# Altium project Анализатор .034 -лист 4.PrjPcb
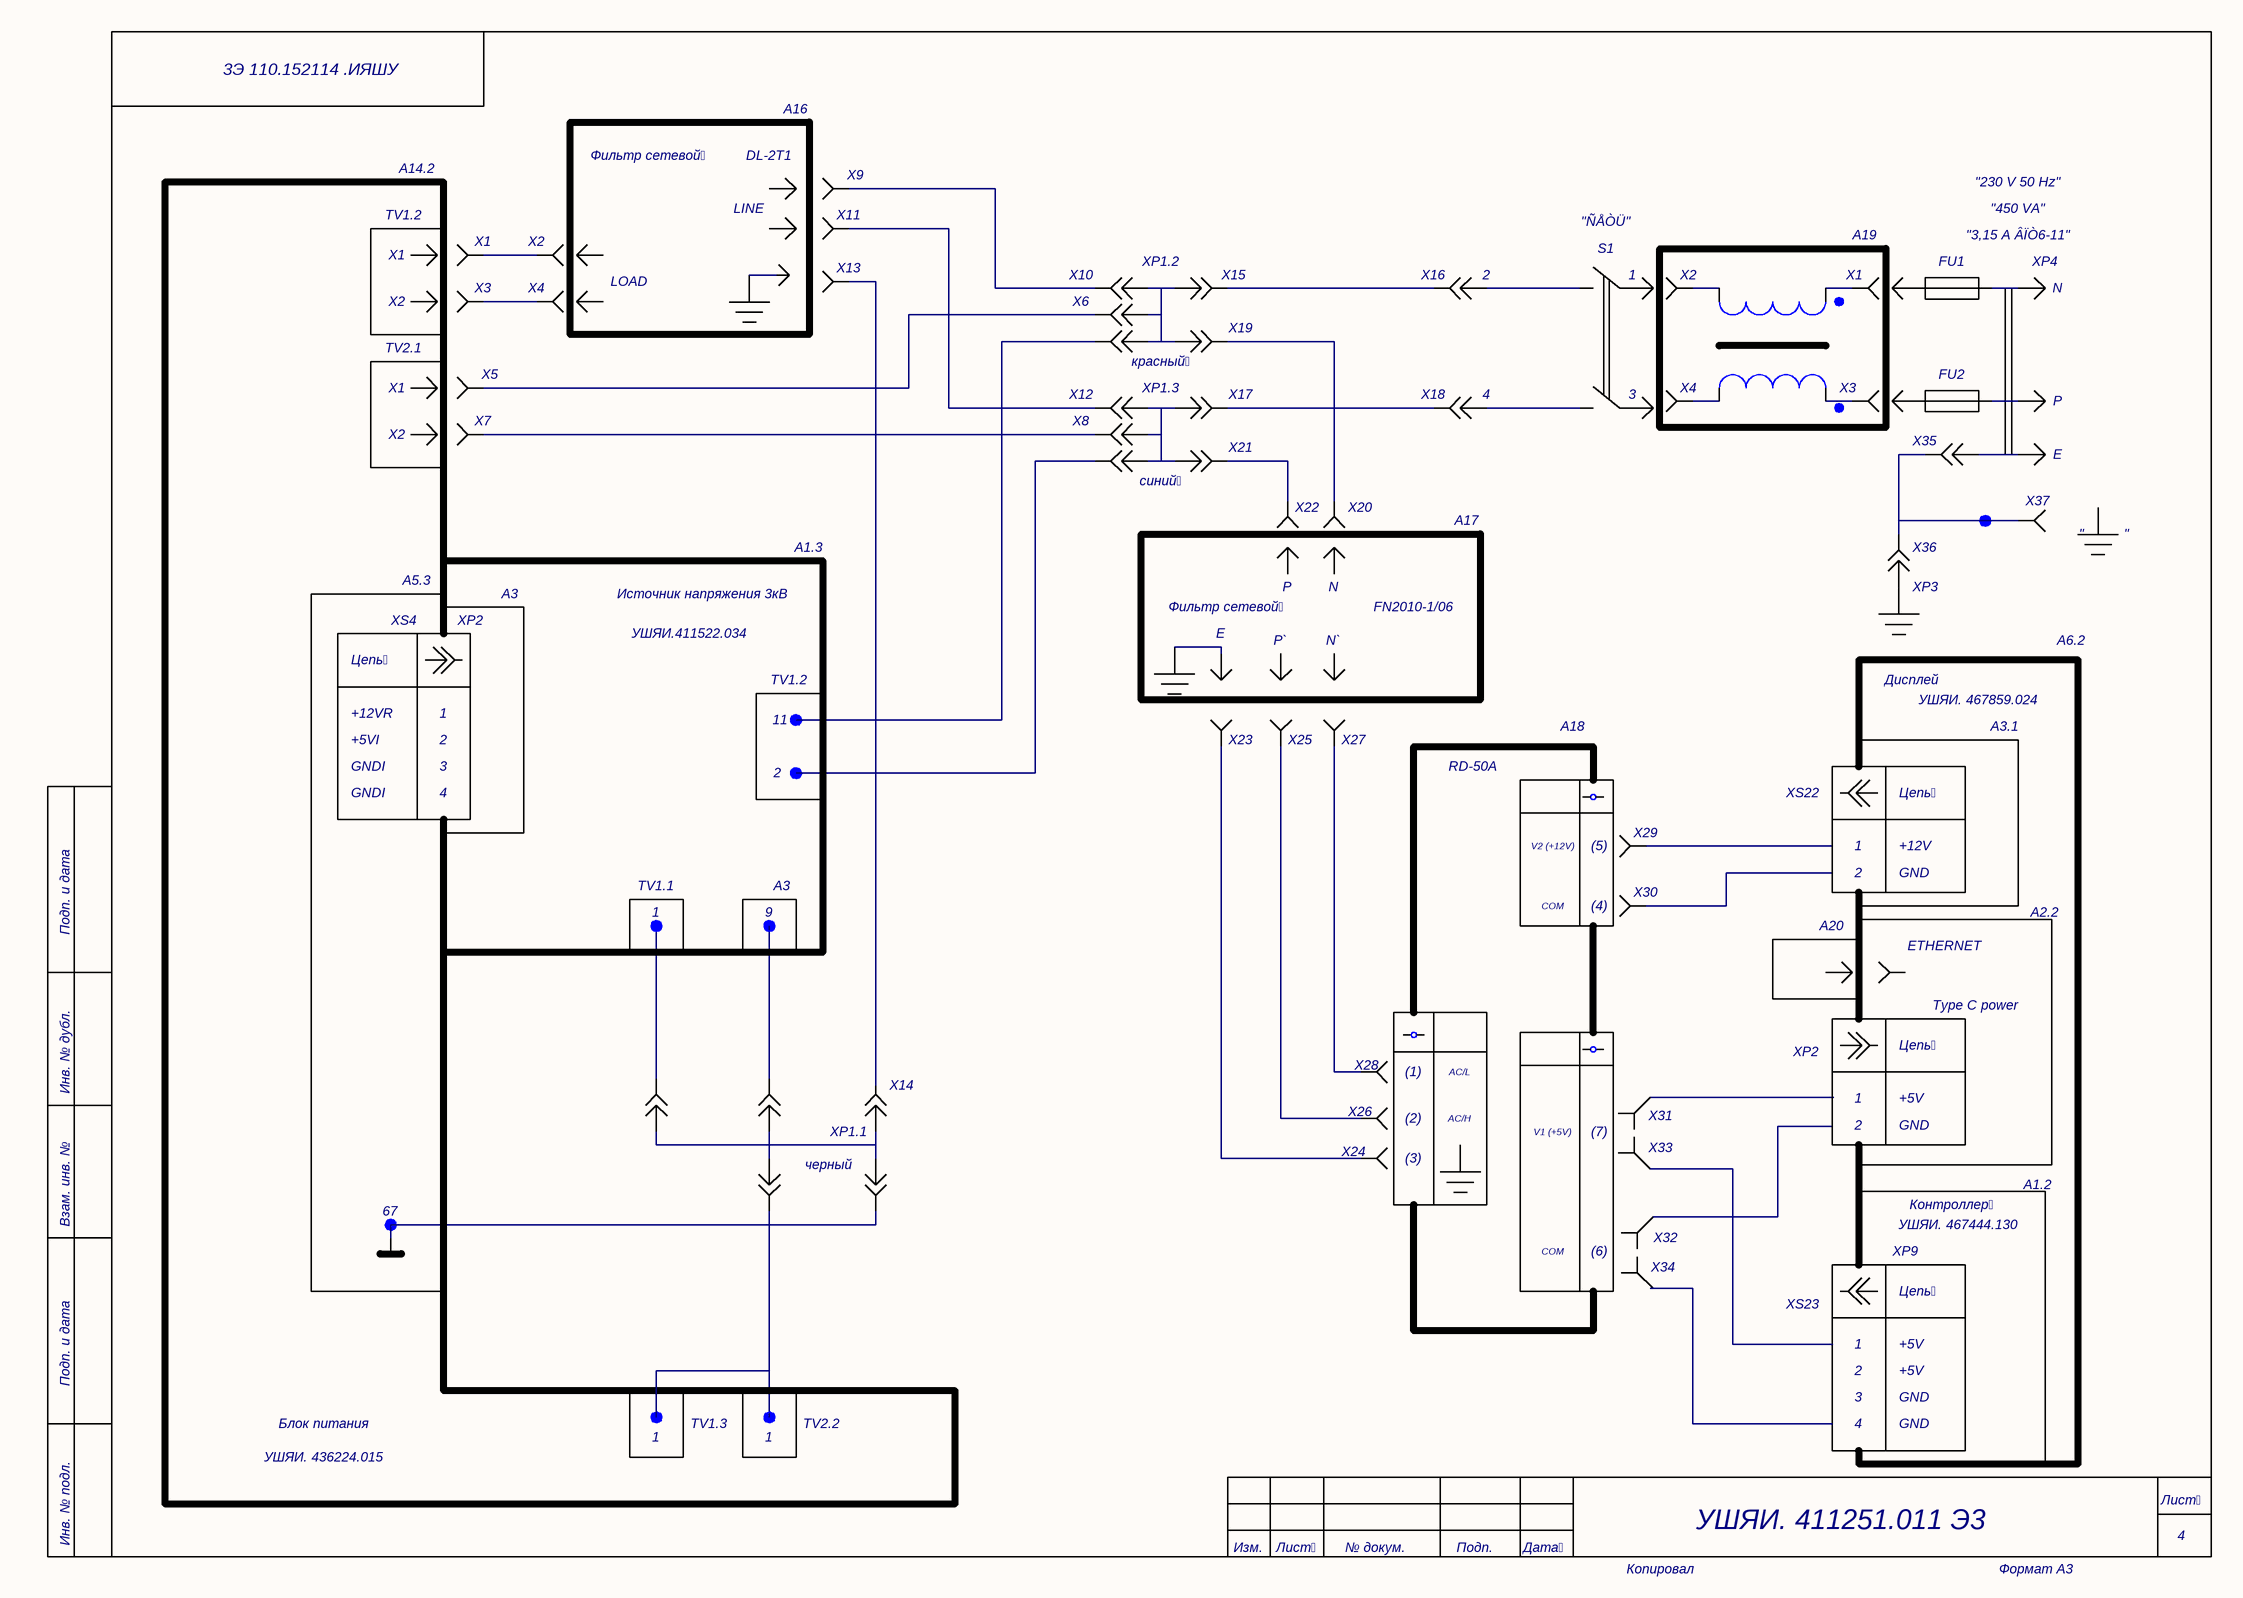
[diagram p0: Sheet1.SCHDOC]
1 sheet, 101 parts. Net scope: global (net labels, ports and power ports of the same name join across sheets).

## Sheet Sheet1.SCHDOC
size 420 x 297 mm; SheetNumber: 1; SheetTotal: 1; DocumentName: Sheet1.SCHDOC

### Parts
39  VT2  (value not drawn)
40  VT2  (value not drawn)
41  VT2  (value not drawn)
42  VT2  (value not drawn)
FU1  RESISTANCE  (value not drawn)
FU2  RESISTANCE  (value not drawn)
S1  KEY  (value not drawn)
U81  SOCKET  (value not drawn)
U172  KEY  (value not drawn)
U173  POINT (SMALL)  (value not drawn)
U174  POINT (SMALL)  (value not drawn)
U200  PLUG  (value not drawn)
U201  PLUG  (value not drawn)
U202  PLUG  (value not drawn)
U203  PLUG  (value not drawn)
U204  PLUG  (value not drawn)
U205  PLUG  (value not drawn)
U207  PLUG  (value not drawn)
U208  PLUG  (value not drawn)
U212  PLUG  (value not drawn)
U213  PLUG  (value not drawn)
U214  PLUG  (value not drawn)
U215  PLUG  (value not drawn)
U216  PLUG  (value not drawn)
U217  PLUG  (value not drawn)
U219  PLUG  (value not drawn)
U221  PLUG  (value not drawn)
U222  PLUG  (value not drawn)
U223  PLUG  (value not drawn)
U224  PLUG  (value not drawn)
U225  PLUG  (value not drawn)
U226  PLUG  (value not drawn)
U227  PLUG  (value not drawn)
U233  PLUG  (value not drawn)
U234  PLUG  (value not drawn)
U235  PLUG  (value not drawn)
U236  PLUG  (value not drawn)
U237  PLUG  (value not drawn)
U238  GROUND  (value not drawn)
U239  CASE  (value not drawn)
U240  PLUG  (value not drawn)
U241  PLUG  (value not drawn)
U249  CASE  (value not drawn)
U251  PLUG  (value not drawn)
U252  CASE  (value not drawn)
U253  PLUG  (value not drawn)
U254  CASE  (value not drawn)
U255  PLUG  (value not drawn)
U256  CASE  (value not drawn)
U260  PLUG  (value not drawn)
U261  PLUG  (value not drawn)
U262  PLUG  (value not drawn)
U265  PLUG  (value not drawn)
U266  PLUG  (value not drawn)
U267  PLUG  (value not drawn)
U268  PLUG  (value not drawn)
U269  PLUG  (value not drawn)
XP1  PLUG  (value not drawn)
XS24  SOCKET  (value not drawn)
XS25  SOCKET  (value not drawn)
XS26  SOCKET  (value not drawn)
XS27  SOCKET  (value not drawn)
XS28  SOCKET  (value not drawn)
XS29  SOCKET  (value not drawn)
XS30  SOCKET  (value not drawn)
XS31  SOCKET  (value not drawn)
XS32  SOCKET  (value not drawn)
XS33  SOCKET  (value not drawn)
XS34  SOCKET  (value not drawn)
XS35  SOCKET  (value not drawn)
XS36  SOCKET  (value not drawn)
XS37  SOCKET  (value not drawn)
XS38  SOCKET  (value not drawn)
XS39  SOCKET  (value not drawn)
XS40  SOCKET  (value not drawn)
XS41  SOCKET  (value not drawn)
XS42  SOCKET  (value not drawn)
XS43  SOCKET  (value not drawn)
XS44  SOCKET  (value not drawn)
XS45  SOCKET  (value not drawn)
XS46  SOCKET  (value not drawn)
XS47  SOCKET  (value not drawn)
XS48  SOCKET  (value not drawn)
XS49  SOCKET  (value not drawn)
XS50  SOCKET  (value not drawn)
XS52  SOCKET  (value not drawn)
XS53  SOCKET  (value not drawn)
XS55  SOCKET  (value not drawn)
XS56  SOCKET  (value not drawn)
XS57  SOCKET  (value not drawn)
XS58  SOCKET  (value not drawn)
XS59  SOCKET  (value not drawn)
XS60  SOCKET  (value not drawn)
XS61  SOCKET  (value not drawn)
XS62  SOCKET  (value not drawn)
XS63  SOCKET  (value not drawn)
XS64  SOCKET  (value not drawn)
XS65  SOCKET  (value not drawn)
XS66  SOCKET  (value not drawn)
XS67  SOCKET  (value not drawn)
XS68  SOCKET  (value not drawn)

### Nets
Net39_0: 39.0 XS26.1
Net40_0: 40.0 XS28.1
Net41_0: 41.0 XS29.1
Net42_0: 42.0 XS27.1
NetFU1_1: FU1.1 U204.1
NetFU1_2: FU1.2 XP1.1
NetFU2_1: FU2.1 U205.1
NetFU2_2: FU2.2 U207.1
NetS1_1: S1.1 U202.1
NetS1_2: S1.2 U200.1
NetU172_1: U172.1 U203.1
NetU172_2: U172.2 U201.1
NetU208_1: U208.1 U222.1
NetU212_1: U212.1 U213.1 U214.1 U217.1 U219.1
NetU215_1: U215.1 U216.1 U221.1 U224.1 U225.1
NetU223_1: U223.1 U239.1(DGND)
NetU233_1: U233.1 U234.1 U235.1 U236.1 U237.1
NetU238_1: U238.1 XS62.1
NetU252_1: U252.1(DGND) U261.1
NetU254_1: U254.1(DGND) U262.1
NetXS24_1: XS24.1 XS30.1
NetXS25_1: XS25.1 XS53.1
NetXS32_1: XS32.1 XS61.1
NetXS34_1: XS34.1 XS55.1
NetXS35_1: XS35.1 XS57.1
NetXS36_1: XS36.1 XS58.1
NetXS39_1: XS39.1 XS46.1
NetXS40_1: XS40.1 XS41.1
NetXS42_1: XS42.1 XS60.1
NetXS43_1: XS43.1 XS44.1 XS45.1
NetXS47_1: XS47.1 XS59.1
NetXS48_1: XS48.1 XS52.1
NetXS50_1: XS50.1 XS56.1
NetXS63_1: XS63.1 XS66.1
NetXS64_1: XS64.1 XS65.1

Not connected (* = marked no-connect by the designer): U81 1; U173 0; U174 0; U226 1; U227 1; U240 1; U241 1; U249 1(DGND); U251 1; U253 1; U255 1; U256 1(DGND); U260 1; U265 1; U266 1; U267 1; U268 1; U269 1; XS31 1; XS33 1; XS37 1; XS38 1; XS49 1; XS67 1; XS68 1

### Notes on the sheet
- 3Э 110.152114 .ИЯШУ
- A16
- A14.2
- Фильтр сетевой
- (near U265) DL-2T1
- (near XS55) X9
- "230 V 50 Hz"
- (near U240) X1
- (near U240) TV1.2
- (near XS60) X1
- (near XS42) X2
- LINE
- (near XS56) X11
- XP1.2
- S1
- "ÑÅÒÜ"
- A19
- (near FU1) FU1
- "450 VA"
- "3,15 A ÂÏÒ6-11"
- (near XP1) XP4
- (near U251) X2
- (near XS59) X3
- (near XS47) X4
- LOAD
- (near XS61) X13
- X6
- (near XS34) X10
- (near XS30) X15
- (near XS41) X19
- (near XS24) X16
- (near U200) 2
- 1
- (near XS26) X2
- X1
- (near XP1) N
- (near U241) X1
- TV2.1
- (near XS64) X5
- (near XS50) X12
- XP1.3
- красный
- (near XS53) X17
- (near XS25) X18
- (near U201) 4
- 3
- (near XS27) X4
- X3
- (near FU2) FU2
- (near U207) P
- (near U255) X2
- (near XS63) X7
- X8
- (near XS52) X21
- (near XS43) X35
- (near U208) E
- синий
- X22
- (near XS40) X20
- A17
- (near XS45) X37
- "          "
- A5.3
- A3
- Источник напряжения 3кВ
- A1.3
- (near U253) P
- (near U260) N
- XP3
- X36
- Цепь
- XS4
- XP2
- УШЯИ.411522.034
- E
- (near U267) P`
- (near U268) N`
- FN2010-1/06
- A6.2
- +12VR
- 11
- TV1.2
- A18
- Дисплей
- УШЯИ. 467859.024
- A3.1
- GNDI
- +5VI
- 4
- 2
- (near XS46) X23
- (near XS58) X25
- (near XS57) X27
- RD-50A
- XS22
- V2 (+12V)
- (near XS68) (5)
- (near XS68) X29
- GND
- +12V
- Подп. и дата
- TV1.1
- 9
- COM
- (near XS67) (4)
- (near XS67) X30
- A20
- A2.2
- (near U81) Type C power
- (near U81) ETHERNET
- (near XS35) X28
- (near XS35) (1)
- AC/L
- Инв. № дубл.
- (near U213) XP1.1
- X14
- (near XS36) X26
- (2)
- (near U256) AC/H
- V1 (+5V)
- (7)
- X31
- +5V
- (near U238) 67
- черный
- (near XS39) X24
- (3)
- X33
- Контроллер
- A1.2
- Взам. инв. №
- (6)
- X34
- X32
- XP9
- УШЯИ. 467444.130
- XS23
- УШЯИ. 436224.015
- Блок питания
- TV1.3
- TV2.2
- Инв. № подл.
- УШЯИ. 411251.011 Э3
- Лист
- Изм.
- № докум.
- Подп.
- Дата
- Копировал
- Формат А3

### Library data of the parts
U200 = PLUG: Value: 2
U201 U222 U223 = PLUG: Value: 4
U202 U213 U214 U217 U219 U233 U234 U236 U237 U240 U241 U251 U253 U255 U260-U262 U265-U269 = PLUG: Value: 1
U203 U212 U215 U216 U221 U224-U227 U235 = PLUG: Value: 3
39-42 = VT2: Value: *
FU1 FU2 = RESISTANCE: Value: *
S1 U172 = KEY: Value: *
U81 XS24-XS50 XS52 XS53 XS55-XS68 = SOCKET: Value: *
U173 U174 = POINT (SMALL): Value: *
U204 U205 U207 U208 XP1 = PLUG: Value: *